# EAGLE board Cing_MainBoard (EAGLE 9.4.0), part 1 of 2
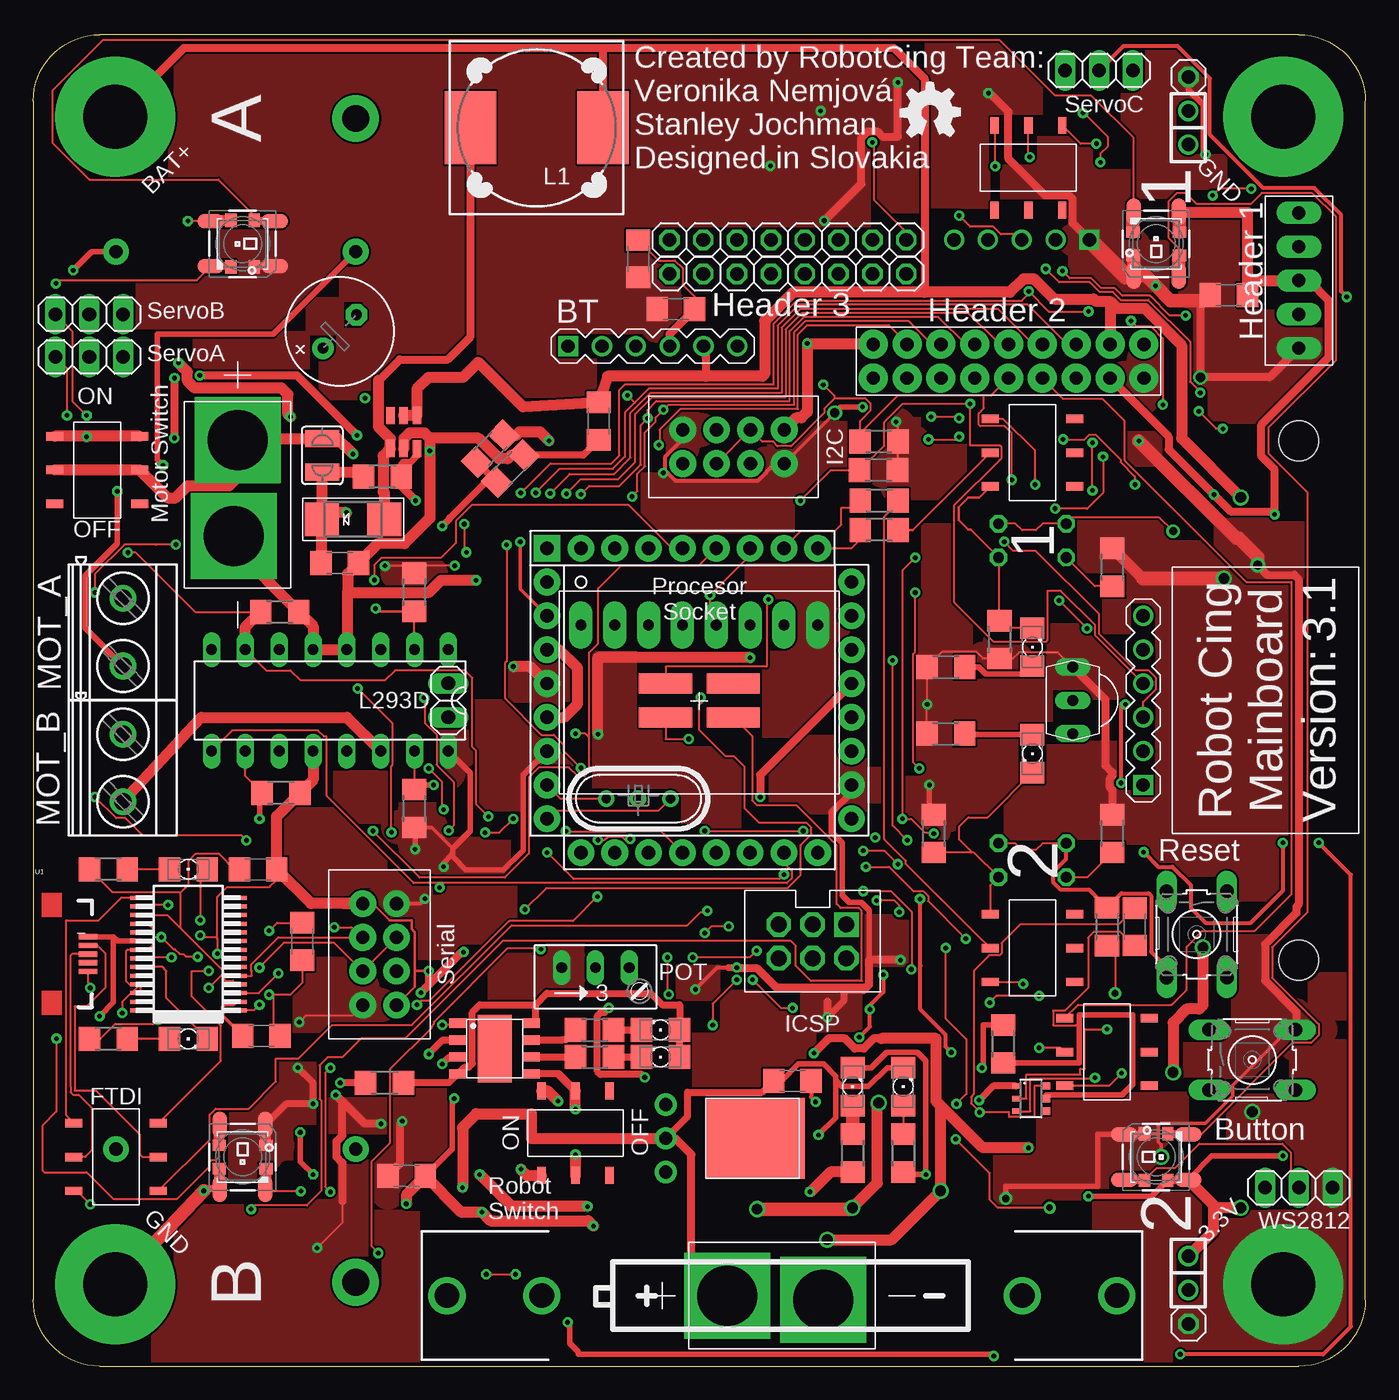
[diagram p6: board, top side]
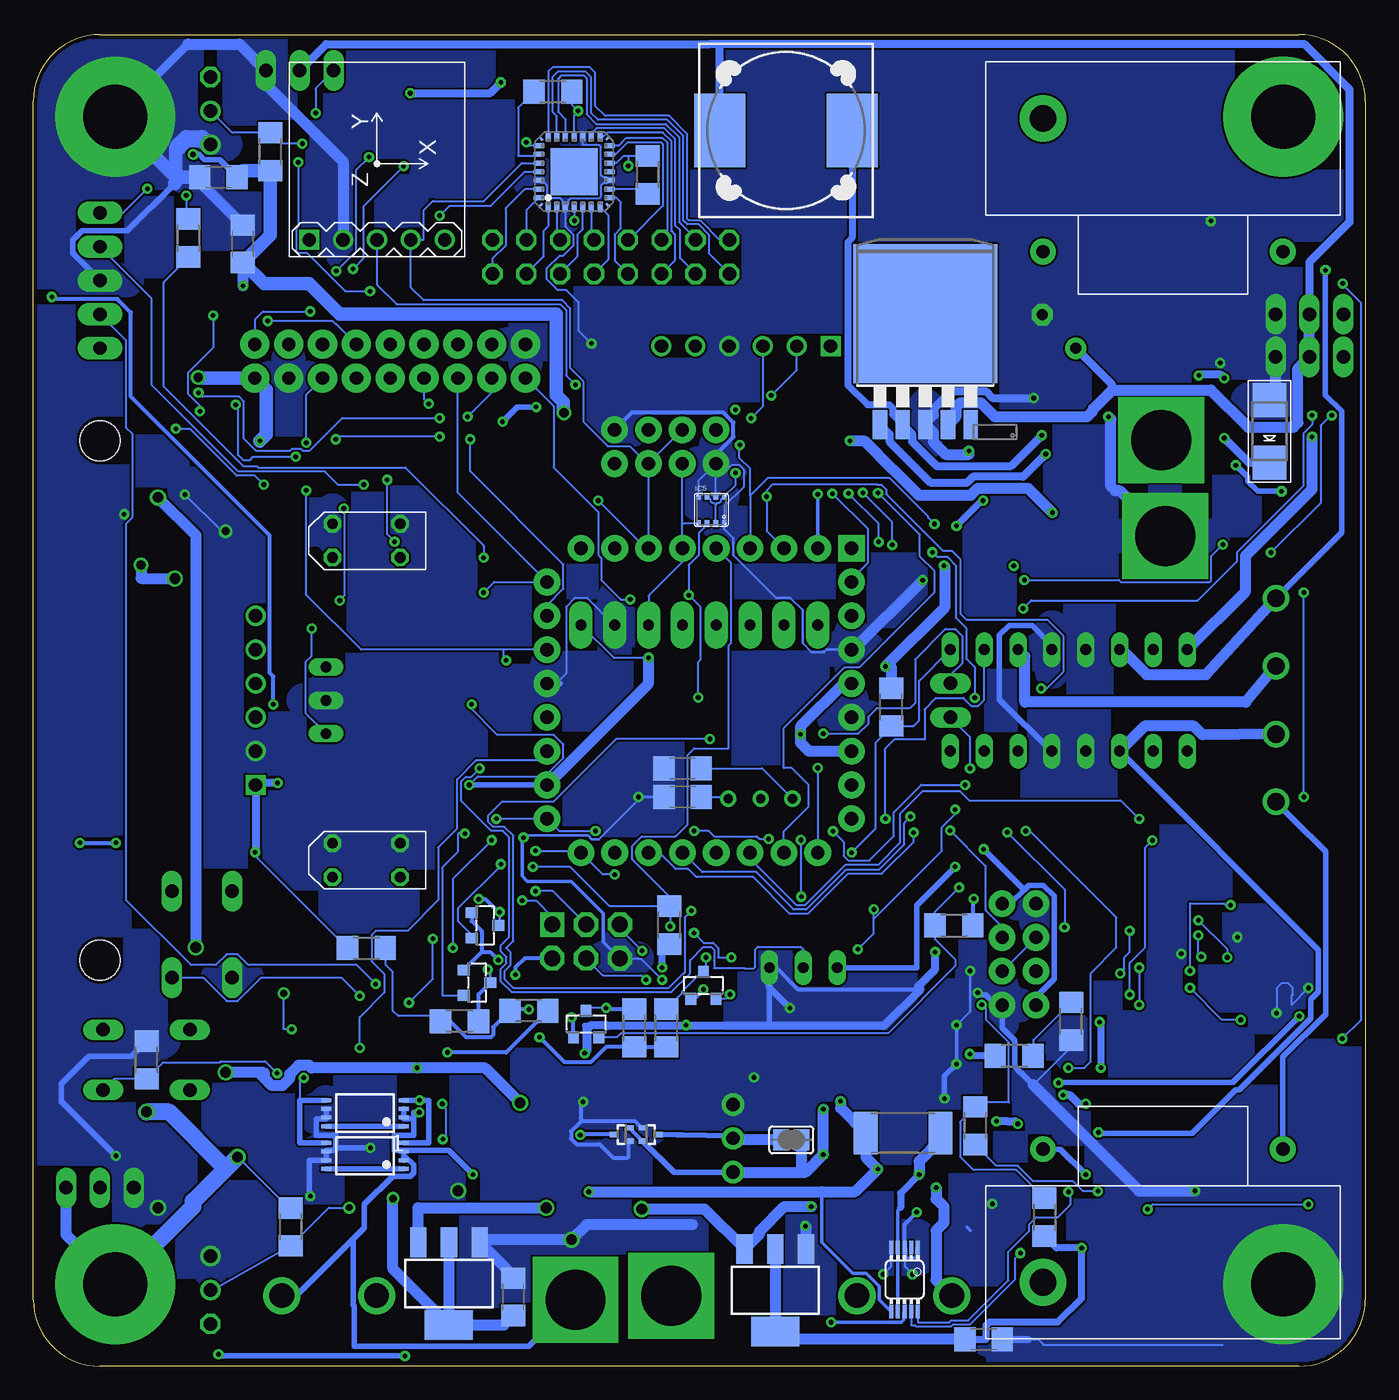
[diagram p7: board, bottom side, seen from below]

Size 100 x 100 mm. Coordinates in mm from the lower left corner, seen from the top.
Outline: 5,0 95,0 arc90 100,5 100,95 arc90 95,100 5,100 arc90 0,95 0,5 arc90 5,0
Copper layers (1*16): Top 0.035mm / dielectric 1.5mm / Bottom 0.035mm
Design rules "default *": minimum track width 6mil, minimum drill 0.35mm, track to track 6mil, track to pad 6mil, pad to pad 6mil, via to via 6mil, smd to smd 6mil, copper to edge 10mil, drill to drill 6mil, minimum pad ring 10mil, minimum via ring 8mil, stop-mask expansion 4mil, vias tented up to drill 0mil, thermal gap 10mil

## Footprints (pad centres in the part's own frame; a part is rotated, then mirrored left to right if it is on the bottom)
TSSOP-8 = smd 0.3 x 0.75: 1 -0.975,-2.925; 2 -0.325,-2.925; 3 0.325,-2.925; 4 0.975,-2.925; 5 0.975,2.925; 6 0.325,2.925; 7 -0.325,2.925; 8 -0.975,2.925
BATTERY-AA-KIT = drill 1.854: GND@1 25.146,0; GND@2 18.034,0; PWR@1 -25.146,0; PWR@2 -18.034,0
C1206 = smd 1.6 x 1.8: 1 -1.4,0; 2 1.4,0
E3,5-8 = drill 0.813 pad 1.6: + -1.778,0 | drill 0.813 pad 1.6 octagon: - 1.778,0
SMADIODE = smd 2.54 x 2.54: A 2.349,0; C -2.349,0
L293 = drill 0.813 long: 1 -8.89,-3.81; 2 -6.35,-3.81; 3 -3.81,-3.81; 4 -1.27,-3.81; 5 1.27,-3.81; 6 3.81,-3.81; 7 6.35,-3.81; 8 8.89,-3.81; 9 8.89,3.81; 10 6.35,3.81; 11 3.81,3.81; 12 1.27,3.81; 13 -1.27,3.81; 14 -3.81,3.81; 15 -6.35,3.81; 16 -8.89,3.81
TO263-5 = smd 1.067 x 2.159: 1 -3.404,-5.791; 2 -1.702,-5.791; 3 0,-5.791; 4 1.702,-5.791; 5 3.404,-5.791 | smd 10.8 x 10.41: 6 0,2.54
FT232RL = smd 0.3 x 1.5: 1 -4.225,-3.625; 2 -3.575,-3.625; 3 -2.925,-3.625; 4 -2.275,-3.625; 5 -1.625,-3.625; 6 -0.975,-3.625; 7 -0.325,-3.625; 8 0.325,-3.625; 9 0.975,-3.625; 10 1.625,-3.625; 11 2.275,-3.625; 12 2.925,-3.625; 13 3.575,-3.625; 14 4.225,-3.625; 15 4.225,3.625; 16 3.575,3.625; 17 2.925,3.625; 18 2.275,3.625; 19 1.625,3.625; 20 0.975,3.625; 21 0.325,3.625; 22 -0.325,3.625; 23 -0.975,3.625; 24 -1.625,3.625; 25 -2.275,3.625; 26 -2.925,3.625; 27 -3.575,3.625; 28 -4.225,3.625
BME280 = smd 0.35 x 0.5: 1 0.975,-1.025; 2 0.325,-1.025; 3 -0.325,-1.025; 4 -0.975,-1.025; 5 -0.975,1.025; 6 -0.325,1.025; 7 0.325,1.025; 8 0.975,1.025
IRFU9024 = drill 1 pad 1.676: D 0,0; G -2.54,0; S 2.54,0 | smd 6.096 x 7.366: P$1 0,6.731
1X01 = drill 1.016 octagon: 1 0,0
1X03 = drill 1.016 long: 1 -2.54,0; 2 0,0; 3 2.54,0
ICSP_HEADER = drill 1.2 pad 1.829 square: 1 -1.27,2.54 | drill 1.2 pad 1.829 octagon: 2 1.27,2.54; 3 -1.27,0; 4 1.27,0; 5 -1.27,-2.54; 6 1.27,-2.54
1X02 = drill 1.016 long: 1 -1.27,0; 2 1.27,0
DR125 = smd 3.85 x 5.5: 1 -4.975,0; 2 4.975,0
DR127 = smd 3.85 x 5.5: 1 -4.975,0; 2 4.975,0
1206 = smd 1.6 x 1.803: A -1.422,0; C 1.422,0
LED3535 = smd 1 x 0.85: 1 -1.75,0.875; 2 -1.75,-0.875; 3 1.75,-0.875; 4 1.75,0.875
WS2812B = smd 2 x 1.1: 1 -2.4,1.7; 2 -2.4,-1.7; 3 2.4,-1.7; 4 2.4,1.7
TCRT5000 = drill 0.8 octagon: A -2.54,1.27; C 2.54,1.27; E 2.54,-1.27; K -2.54,-1.27
MKDSN1,5/2-5,08 = drill 1.3 pad 2: 1 -2.561,0.025; 2 2.519,0.025
RJ9W = drill 0.813 long: A 2.54,0.635; E -2.54,0.635; S 0,0.635
HC49U = drill 0.7 pad 1.2: 1 -2.413,0; 2 -0.027,0; 3 2.413,0
SOT23 = smd 0.8 x 0.9: 1 -0.95,-1; 2 0.95,-1; 3 0,1
SC75_INFINEON = smd 0.4 x 0.65: 1 -0.5,-0.575; 2 0,0.575; 3 0.5,-0.575
R1206 = smd 1.6 x 1.803: 1 -1.422,0; 2 1.422,0
LDR_OFFBOARD = drill 1.016: 1 -1.27,0; 2 1.27,0
R2512 = smd 1.8 x 3.2: 1 -2.8,0; 2 2.8,0
B3F-10XX = drill 1.016 long: 1 -3.251,2.261; 2 3.251,2.261; 3 -3.251,-2.261; 4 3.251,-2.261
SJW = smd 1.27 x 2.54: 1 -1.27,0; 2 1.27,0
SJ = smd 1.168 x 1.6: 1 -0.762,0; 2 0.762,0
USB_SWITCH = smd 1.27 x 0.635: CH1A -3.175,2.54; CH1B -3.175,-2.54; CH2A 3.175,2.54; CH2B 3.175,-2.54; COM1 -3.175,0; COM2 3.175,0
TP4056 = smd 1.3 x 0.7: 1 -2.75,1.905; 2 -2.75,0.635; 3 -2.75,-0.635; 4 -2.75,-1.905; 5 2.75,-1.905; 6 2.75,-0.635; 7 2.75,0.635; 8 2.75,1.905 | smd 2.54 x 5.08: RADIATOR 0,0
TSOP18XX = drill 0.813 long: GND -0.001,-0.027; OUT -2.501,-0.027; VCC 2.499,-0.027
USB-MICRO-SMD = smd 1.4 x 0.4: D+1 2.7,0; D-1 2.7,0.65; GND1 2.7,-1.3; ID1 2.7,-0.65; VBUS1 2.7,1.3
MPU-6050 = drill 0.8 pad 1.778 long: ADO 0,-6.35; GND 0,6.35; INT 0,-8.89; SCL 0,3.81; SDA 0,1.27; VCC 0,8.89; XCL 0,-3.81; XDA 0,-1.27
PROCESSOR-SOCKET_PCB = smd 4 x 1.5: 32 2.54,1.27; 36 -2.54,1.27; D+ 2.54,-1.27; D- -2.54,-1.27 | drill 1 pad 2: A0 11.43,6.35; A1 11.43,8.89; A2 8.89,11.43; A3 6.35,11.43; A4 3.81,11.43; A5 1.27,11.43; A6 11.43,-3.81; A7 11.43,3.81; AREF 11.43,-1.27; CRYST1 -11.43,-6.35; CRYST2 -11.43,-8.89; D0 -3.81,11.43; D1 -6.35,11.43; D2 -8.89,11.43; D3 -11.43,8.89; D4 -11.43,6.35; D5 -8.89,-11.43; D6 -6.35,-11.43; D7 -3.81,-11.43; D8 -1.27,-11.43; D9 1.27,-11.43; D10 3.81,-11.43; D11 6.35,-11.43; D12 8.89,-11.43; D13 11.43,-8.89; GND -11.43,3.81; GND2 -11.43,-1.27; GND3 11.43,1.27; RESET -1.27,11.43; VCC -11.43,1.27; VCC2 -11.43,-3.81; VCC3 11.43,-6.35 | drill 1 pad 2 square: P$1 -11.43,11.43
BIG_HEADER = drill 1 pad 2.184: +3V3 1.27,10.16; +5V -1.27,7.62; +5V1 1.27,-10.16; A0 1.27,-7.62; A1 1.27,-5.08; A4 1.27,-2.54; A5 1.27,0; A6 1.27,2.54; A7 1.27,5.08; D0 -1.27,-7.62; D1 -1.27,-5.08; D2 -1.27,-2.54; D3 -1.27,0; D4 -1.27,2.54; D5 -1.27,5.08; D6 -1.27,10.16; GND -1.27,-10.16; GND2 1.27,7.62
I2_HEADER = drill 1 pad 2: 5V 1.27,3.81; +5V -1.27,-3.81; GND1 -1.27,3.81; GND2 1.27,-3.81; SCL 1.27,-1.27; SCL2 -1.27,1.27; SDA 1.27,1.27; SDA2 -1.27,-1.27
SERIAL_HEADER = drill 1 pad 2: 5V 1.27,3.81; +5V -1.27,-3.81; GND -1.27,3.81; GND2 1.27,-3.81; RXD -1.27,-1.27; RXD2 1.27,1.27; TXD -1.27,1.27; TXD2 1.27,-1.27
SOT23-6 = smd 1.27 x 0.635: P$1 0,0; P$2 0,-1; P$3 0,-2; P$4 2.5,-2; P$5 2.5,-1; P$6 2.5,0
BATTERY_CONECTOR_D = drill 4.5 pad 6.452 square: + 4.1,0; - -3.1,0.3
SOT23-6' = smd 0.4 x 0.55: 1 -0.95,-1.15; 2 0,-1.15; 3 0.95,-1.15 | smd 0.55 x 0.55: 4 0.95,1.15; 5 0,1.15; 6 -0.95,1.15
POLULU_MOTOR = drill 1 pad 1.93: + -10,9; - -10,-9 | drill 2 pad 3.5: P$1 0,9; P$2 0,-9
LM1117 = smd 1.219 x 2.235: 1 -2.311,-3.099; 2 0,-3.099; 3 2.311,-3.099 | smd 3.6 x 2.2: TAB 0,3.099
CONNECTOR_1X5 = drill 1 pad 1.676 long: +5V 0,-5.08; A1 0,5.08; A2 0,2.54; A3 0,-2.54; GND 0,0
MSOP10_0.5 = smd 0.3 x 1.02: 1 -1,-2.4; 2 -0.5,-2.4; 3 0,-2.4; 4 0.5,-2.4; 5 1,-2.4; 6 1,2.4; 7 0.5,2.4; 8 0,2.4; 9 -0.5,2.4; 10 -1,2.4
RANGING-SENSOR-VL53L0X = drill 1 square: 1 -3.81,6.35 | drill 1: 2 -3.81,3.81; 3 -3.81,1.27; 4 -3.81,-1.27; 5 -3.81,-3.81; 6 -3.81,-6.35
COMPASS-HMC5883L = drill 1 square: 1 -5.715,5.08 | drill 1: 2 -5.715,2.54; 3 -5.715,0; 4 -5.715,-2.54; 5 -5.715,-5.08
LEGO-1X1 = drill 4.8 pad 9: LEGO 0,0
BALL = hole 3: 0,19.5; 0,-19.5
QFN28 = smd 0.8 x 0.4: 1 -2.65,1.95; 2 -2.65,1.3; 3 -2.65,0.65; 4 -2.65,0; 5 -2.65,-0.65; 6 -2.65,-1.3; 7 -2.65,-1.95; 15 2.65,-1.95; 16 2.65,-1.3; 17 2.65,-0.65; 18 2.65,0; 19 2.65,0.65; 20 2.65,1.3; 21 2.65,1.95 | smd 0.4 x 0.8: 8 -1.95,-2.65; 9 -1.3,-2.65; 10 -0.65,-2.65; 11 0,-2.65; 12 0.65,-2.65; 13 1.3,-2.65; 14 1.95,-2.65; 22 1.95,2.65; 23 1.3,2.65; 24 0.65,2.65; 25 0,2.65; 26 -0.65,2.65; 27 -1.3,2.65; 28 -1.95,2.65 | smd 3.55 x 3.55: M 0,0 | smd 0.17 x 0.4 rotated 45: R1 -2.525,2.525 | smd 0.17 x 0.4 rotated 135: R2 -2.525,-2.525 | smd 0.17 x 0.4 rotated 225: R3 2.525,-2.525 | smd 0.17 x 0.4 rotated 315: R4 2.5,2.5
WIRELESS-BLUETOOTH-HC-05 = drill 1 square: 1 -6.35,0 | drill 1: 2 -3.81,0; 3 -1.27,0; 4 1.27,0; 5 3.81,0; 6 6.35,0

## Placement (x,y rotation side)
1  8205  [TSSOP-8]  75.1,19 90 bottom
8205  8205  [TSSOP-8]  75.1,15.8 90 bottom
BT1  [BATTERY-AA-KIT]  56.2,5.3 0 top
C1  100n  [C1206]  56.98,21.43 0 top
C2  100n  [C1206]  16.87,37.32 0 top
C3  100n  [C1206]  17.12,24.8 0 top
C5  100n  [C1206]  84.26,84.28 90 bottom
C6  100n  [C1206]  86.1,89.3 0 bottom
C7  22p  [C1206]  51.26,44.9 0 bottom
C8  22p  [C1206]  51.26,42.74 0 bottom
C10  100n  [C1206]  28.66,2.01 0 bottom
C11  100n  [C1206]  63.98,5.21 270 bottom
C12  100n  [C1206]  28.02,14.28 0 top
C13  100n  [C1206]  89.75,80.43 0 top
C14  22uf  [C1206]  23,60.3 0 top
C15  22uf  [C1206]  42.44,70.97 270 top
C16  100n  [C1206]  82.7,33 90 top
C17  [E3,5-8]  23,77.7 45 top
C18  100n  [C1206]  20.2,31.9 90 top
C19  100n  [C1206]  48.24,79.39 0 top
C20  100n  [C1206]  45.41,83.16 90 top
D1  [SMADIODE]  7.2,70.2 90 bottom
D3  [SMADIODE]  24,63.6 0 top
IC1  L293D  [L293]  22.27,50 180 top
IC2  LM2576S  [TO263-5]  33.04,76.5 0 bottom
IC3  FT232RL  [FT232RL]  11.63,30.95 90 top
IC5  BME280  [BME280]  49.1,64.3 0 bottom
IRFU9024  IRFU9024  [IRFU9024]  47.48,17.11 270 top
JP1  [1X01]  57.91,82.03 0 top
JP2  ServoA  [1X03]  4.2,75.8 0 top
JP3  ServoB  [1X03]  4.2,79 0 top
JP4  ServoC  [1X03]  80,97.3 0 top
JP5  ICSP  [ICSP_HEADER]  58.5,31.9 270 top
JP6  [1X01]  57.91,84.58 0 top
JP7  [1X01]  60.45,82.03 0 top
JP8  [1X01]  62.99,82.03 0 top
JP9  [1X01]  60.45,84.58 0 top
JP10  [1X01]  62.99,84.58 0 top
JP11  [1X01]  65.53,82.03 0 top
JP12  [1X01]  47.75,84.58 0 top
JP13  [1X01]  47.75,82.03 0 top
JP14  [1X01]  50.29,84.58 0 top
JP15  [1X01]  52.83,82.03 0 top
JP16  [1X01]  52.83,84.58 0 top
JP17  [1X01]  55.37,84.58 0 top
JP18  [1X01]  55.37,82.03 0 top
JP19  [1X01]  50.29,82.03 0 top
JP20  [1X01]  65.53,84.58 0 top
JP21  [1X01]  86.71,3.18 0 top
JP22  [1X01]  86.71,96.82 0 top
JP23  [1X02]  31.15,50 90 top
L1  DR125  [DR125]  37.8,93 180 top
L2  DR127  [DR127]  43.5,92.8 180 bottom
LED1  Charging  [1206]  47.09,25.25 180 top
LED3  RXD  [1206]  11.63,37.32 0 top
LED4  WS2812B3535  [LED3535]  84.29,84.29 0 top
LED5  WS2812B  [WS2812B]  15.71,15.71 270 top
LED6  WS2812B  [WS2812B]  15.71,84.29 180 top
LED7  WS2812B  [WS2812B]  84.29,84.29 90 top
LED8  WS2812B  [WS2812B]  84.29,15.71 0 top
LED9  WS2812B3535  [LED3535]  15.71,84.29 90 top
LED10  WS2812B3535  [LED3535]  15.71,15.71 180 top
LED11  WS2812B3535  [LED3535]  84.29,15.71 270 top
LS1  1  [TCRT5000]  75,62 180 top
LS2  2  [TCRT5000]  75,38 180 top
MOT_A  MKDSN1,5/2-5,08  [MKDSN1,5/2-5,08]  6.7,55.1 270 top
MOT_B  MKDSN1,5/2-5,08  [MKDSN1,5/2-5,08]  6.7,44.9 270 top
ON  GREEN  [1206]  61.5,21 90 top
POT  100k  [RJ9W]  42.2,29.3 0 top
Q1  16mhz  [HC49U]  45.42,42.61 0 top
Q2  BSS138  [SOT23]  58.5,25.7 0 bottom
Q3  BSS138  [SOT23]  49.7,28.6 0 bottom
Q4  BSS138  [SOT23]  66.1,33.1 270 bottom
Q5  BSS138  [SOT23]  66.7,28.8 270 bottom
Q6  NP2301AMR-G  [SC75_INFINEON]  55.84,17.4 90 bottom
Q7  NP2301AMR-G  [SC75_INFINEON]  53.66,17.4 270 bottom
R1  10k  [R1206]  52.27,33.12 270 bottom
R2  10k  [R1206]  91.5,23 270 bottom
R3  40  [R1206]  26.37,21.28 0 top
R4  1k  [R1206]  26.37,23.31 0 bottom
R5  10k  [R1206]  42.13,25.25 180 top
R6  100  [R1206]  65.3,16 90 top
R7  10k  [R1206]  29.3,18.05 90 bottom
R8  1k  [R1206]  22.1,25.9 270 bottom
R9  10k  [R1206]  34.3,68.9 225 top
R10  1k  [R1206]  68.5,52.5 180 top
R11  10k  [R1206]  42.13,23.22 180 top
R12  10k  [R1206]  18.6,43.05 0 top
R13  10k  [R1206]  28.61,41.88 270 top
R14  10k  [R1206]  28.61,58.11 270 top
R15  10k  [R1206]  18.5,56.65 180 top
R16  100  [R1206]  81,40 270 top
R17  1k  [R1206]  67.6,40 270 top
R18  100  [R1206]  81,60 270 top
R19  1k  [R1206]  72.53,54.56 90 top
R20  1k  [R1206]  68.5,47.5 180 top
R21  PHOTOCELL1  [LDR_OFFBOARD]  86.7,7 270 top
R22  100  [R1206]  61.5,16 90 top
R23  PHOTOCELL1  [LDR_OFFBOARD]  86.7,93 90 top
R24  100  [R1206]  5.63,37.32 0 top
R25  100  [R1206]  5.63,24.58 0 top
R26  1k  [R1206]  88.37,84.73 90 bottom
R27  1k  [R1206]  63.5,62.8 0 top
R28  1k  [R1206]  63.5,65 180 top
R29  1k  [R1206]  82.2,91.2 270 bottom
R30  1k  [R1206]  63.48,69.42 0 top
R31  1k  [R1206]  63.45,67.29 0 top
R32  1k  [R1206]  80.69,10.46 90 bottom
R33  10k  [R1206]  54.9,25.4 90 bottom
R34  10k  [R1206]  30.9,33.1 180 bottom
R35  10k  [R1206]  52.5,25.4 90 bottom
R37  10k  [R1206]  62.8,26.7 0 bottom
R38  10k  [R1206]  35.6,49.5 270 bottom
R39  10k  [R1206]  68,25.9 0 bottom
R40  10k  [R1206]  24.1,11.2 90 bottom
R41  2R  [R2512]  34.7,17.5 180 bottom
R42  10k  [R1206]  53.86,89.45 270 bottom
R43  10k  [R1206]  61,95.7 0 bottom
R44  10k  [R1206]  75,31.4 180 bottom
R46  1k  [R1206]  35.8,67.4 45 top
R47  1k  [R1206]  80.6,33 90 top
R48  100  [R1206]  72.8,24.2 90 top
R49  12K  [R1206]  26.2,66.8 0 top
REVERSE  RED  [1206]  65.3,21 90 top
S2  Reset  [B3F-10XX]  87.33,32.43 270 top
S4  Button  [B3F-10XX]  91.5,23 0 top
SJ1  [SJW]  21.7,68.4 90 top
SJ2  [SJ]  43.1,17 0 bottom
SW1  [USB_SWITCH]  6.22,15.71 180 top
SW2  [USB_SWITCH]  75,31.4 0 top
SW3  [USB_SWITCH]  75,68.6 0 top
SW4  [USB_SWITCH]  80.6,23.6 0 top
SW5  [USB_SWITCH]  40.7,17.5 270 top
SW6  [USB_SWITCH]  4.8,67.3 0 top
SW7  [USB_SWITCH]  74.7,90 270 top
TP4056  TP4056  [TP4056]  34.63,23.86 0 top
TSOP4838  TSOP4838  [TSOP18XX]  78,50 90 top
TXD  TXD  [1206]  11.63,24.58 0 top
TXD1  LightSensor 1  [1206]  75,54 90 top
TXD2  LightSensor 2  [1206]  75,46 270 top
U1  [USB-MICRO-SMD]  1.4,30.95 0 top
U3  MPU-6050MPU6050  [MPU-6050]  50,55.66 270 top
U$1  PROCESSOR-SOCKET_PCB  [PROCESSOR-SOCKET_PCB]  50,50 0 top
U$2  Header 2  [BIG_HEADER]  73.21,75.47 270 top
U$3  I2C_HEADER  [I2_HEADER]  52.56,69.05 270 top
U$4  SERIAL_HEADER  [SERIAL_HEADER]  26,30.93 180 top
U$5  MT3608SOT23-6  [SOT23-6]  26.8,68.9 90 top
U$6  BATTERY_CONECTOR_D  [BATTERY_CONECTOR_D]  15.33,65.43 90 top
U$7  BATTERY_CONECTOR_D  [BATTERY_CONECTOR_D]  56.2,5.3 180 top
U$8  DW01  [SOT23-6']  74.9,20.1 270 top
U$9  POLULU_MOTOR  [POLULU_MOTOR]  15.2,6.3 270 bottom
U$10  LM1117  [LM1117]  68.8,6.2 180 bottom
U$11  LM1117  [LM1117]  44.3,5.7 180 bottom
U$12  CONNECTOR_1X5  [CONNECTOR_1X5]  95,81.53 0 top
U$13  ADS1015IDGT  [MSOP10_0.5]  34.6,6.5 180 bottom
U$14  RANGING-SENSOR-VL53L0X  [RANGING-SENSOR-VL53L0X]  79.5,50 180 top
U$15  [COMPASS-HMC5883L]  74.2,90.3 90 bottom
U$16  BAT+  [LEGO-1X1]  6.16,93.84 0 top
U$17  3.3V  [LEGO-1X1]  93.84,6.16 0 top
U$18  GND  [LEGO-1X1]  6.16,6.16 0 top
U$19  GND  [LEGO-1X1]  93.84,93.84 0 top
U$20  BALL  [BALL]  95,50 0 top
U$21  SX1509  [QFN28]  59.4,89.7 90 bottom
U$22  OPENSOURCE  [OSHW_5MM]  67.32,94.12 0 top
U$23  WIRELESS-BLUETOOTH-HC-05  [WIRELESS-BLUETOOTH-HC-05]  46.5,76.6 0 top
U$24  POLULU_MOTOR  [POLULU_MOTOR]  15.2,93.7 90 bottom
VERSION  3.1  [VERSION]  99.5,50 90 top
WS2812  [1X03]  95,13.4 180 top
YELLOW  Full  [1206]  47.09,23.22 180 top